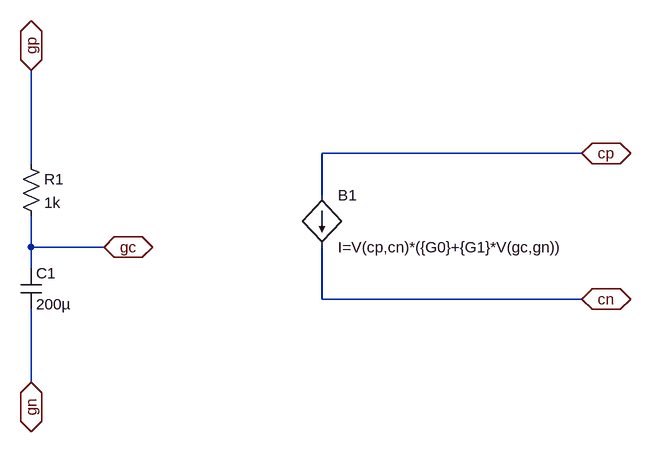
[diagram p0: schematic New_Symbol.asc]
New_Symbol.asc, the LTspice schematic file:
Version 4
SHEET 1 880 680
WIRE 464 64 64 64
WIRE -384 80 -384 -64
WIRE 64 128 64 64
WIRE -384 208 -384 160
WIRE -272 208 -384 208
WIRE -384 240 -384 208
WIRE 64 288 64 208
WIRE 464 288 64 288
WIRE -384 416 -384 304
FLAG 464 64 cp
IOPIN 464 64 BiDir
FLAG 464 288 cn
IOPIN 464 288 BiDir
FLAG -384 -64 gp
IOPIN -384 -64 BiDir
FLAG -272 208 gc
IOPIN -272 208 BiDir
FLAG -384 416 gn
IOPIN -384 416 BiDir
SYMBOL bi 64 128 R0
SYMATTR InstName B1
SYMATTR Value I=V(cp,cn)*({G0}+{G1}*V(gc,gn))
SYMBOL res -400 64 R0
SYMATTR InstName R1
SYMATTR Value 1k
SYMBOL cap -400 240 R0
SYMATTR InstName C1
SYMATTR Value 200µ

The netlist it stands for:
* New_Symbol.asc
B1 cp cn I=V(cp,cn)*({G0}+{G1}*V(gc,gn))
R1 gp gc 1k
C1 gc gn 200µ
.backanno
.end